# Altium schematic sheet MotoControl_V1.0.SchDoc
size A4
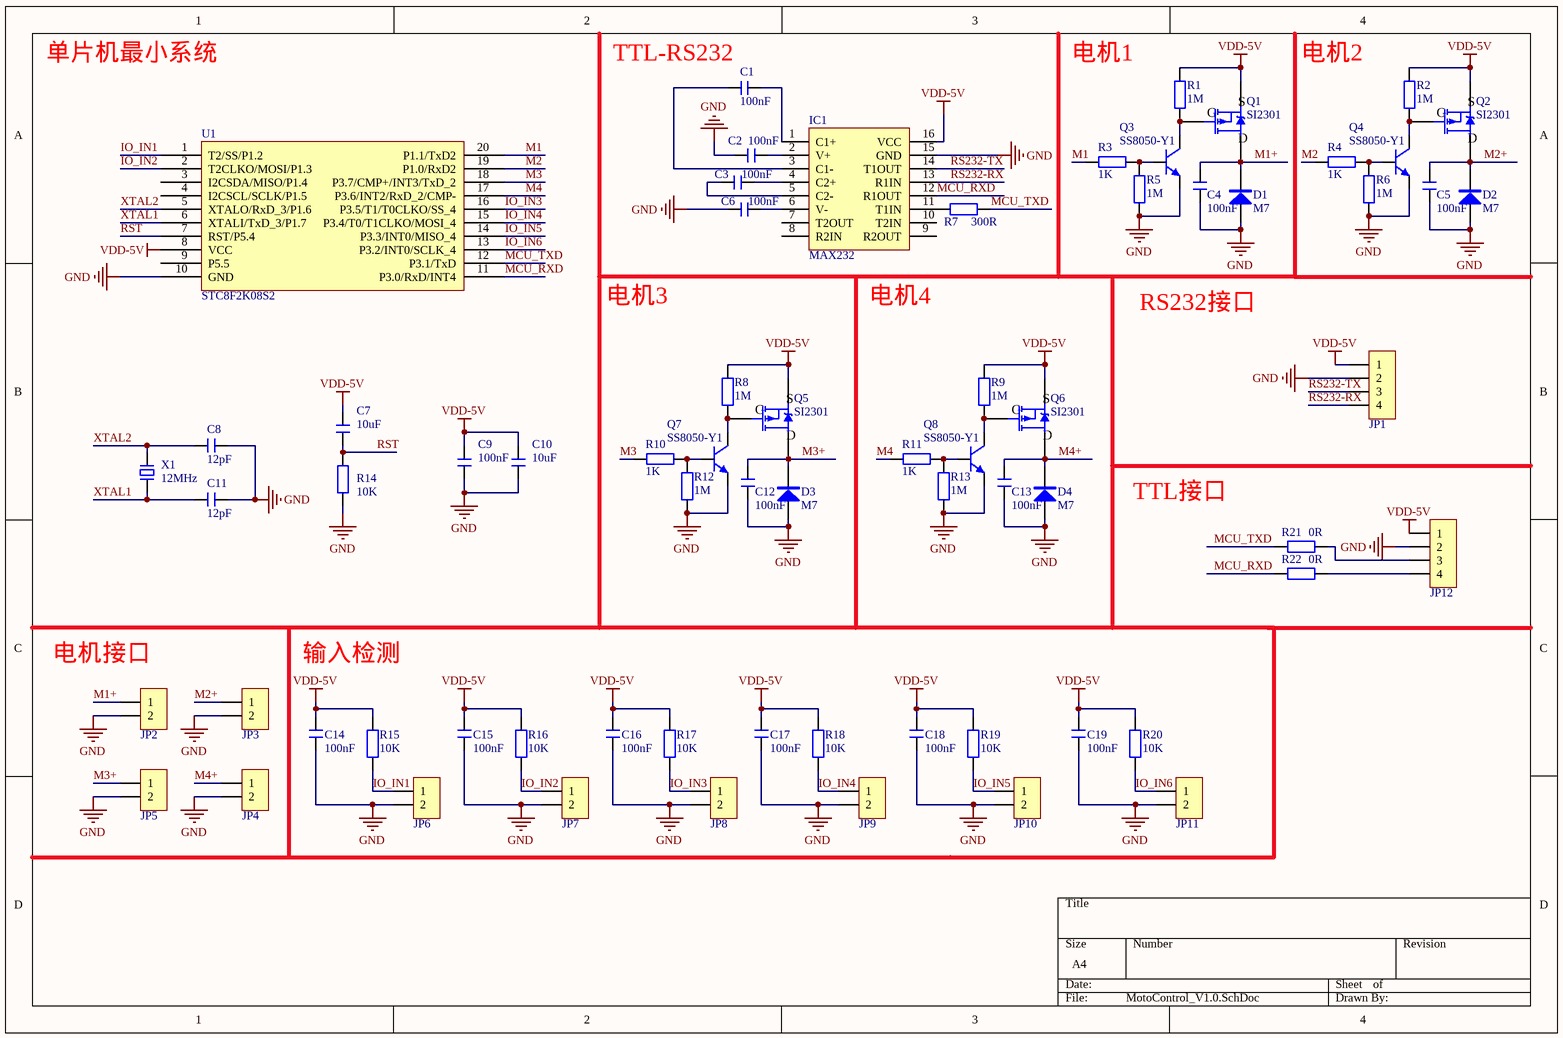
[diagram p0: MotoControl_V1.0.SchDoc]

## Parts
C1  100nF  [C_0603]
C2  100nF  [C_0603]
C3  100nF  [C_0603]
C4  100nF  [C_0603]
C5  100nF  [C_0603]
C6  100nF  [C_0603]
C7  10uF  [C_0603]
C8  12pF  [C_0603]
C9  100nF  [C_0603]
C10  10uF  [C_0603]
C11  12pF  [C_0603]
C12  100nF  [C_0603]
C13  100nF  [C_0603]
C14  100nF  [C_0603]
C15  100nF  [C_0603]
C16  100nF  [C_0603]
C17  100nF  [C_0603]
C18  100nF  [C_0603]
C19  100nF  [C_0603]
D1  M7  [SMA]
D2  M7  [SMA]
D3  M7  [SMA]
D4  M7  [SMA]
IC1  MAX232  [SOP16_N]
JP1  HDR-1X4  [XH2.54-4P]  (value not drawn)
JP2  HDR-1X2  [XH2.54-2P]  (value not drawn)
JP3  HDR-1X2  [XH2.54-2P]  (value not drawn)
JP4  HDR-1X2  [XH2.54-2P]  (value not drawn)
JP5  HDR-1X2  [XH2.54-2P]  (value not drawn)
JP6  HDR-1X2  [XH2.54-2P]  (value not drawn)
JP7  HDR-1X2  [XH2.54-2P]  (value not drawn)
JP8  HDR-1X2  [XH2.54-2P]  (value not drawn)
JP9  HDR-1X2  [XH2.54-2P]  (value not drawn)
JP10  HDR-1X2  [XH2.54-2P]  (value not drawn)
JP11  HDR-1X2  [XH2.54-2P]  (value not drawn)
JP12  HDR-1X4  [XH2.54-4P]  (value not drawn)
Q1  SI2301  [SOT23-3N]
Q2  SI2301  [SOT23-3N]
Q3  SS8050-Y1  [SOT23-3N]
Q4  SS8050-Y1  [SOT23-3N]
Q5  SI2301  [SOT23-3N]
Q6  SI2301  [SOT23-3N]
Q7  SS8050-Y1  [SOT23-3N]
Q8  SS8050-Y1  [SOT23-3N]
R1  1M  [R_0603]
R2  1M  [R_0603]
R3  1K  [R_0603]
R4  1K  [R_0603]
R5  1M  [R_0603]
R6  1M  [R_0603]
R7  300R  [R_0603]
R8  1M  [R_0603]
R9  1M  [R_0603]
R10  1K  [R_0603]
R11  1K  [R_0603]
R12  1M  [R_0603]
R13  1M  [R_0603]
R14  10K  [R_0603]
R15  10K  [R_0603]
R16  10K  [R_0603]
R17  10K  [R_0603]
R18  10K  [R_0603]
R19  10K  [R_0603]
R20  10K  [R_0603]
R21  0R  [R_0603]
R22  0R  [R_0603]
U1  STC8F2K08S2  [TSSOP20_N]
X1  12MHz  [SMD-3215_2P]

## Nets
GND: C2.1 C4.2 C5.2 C6.1 C8.2 C9.1 C10.1 C11.2 C12.2 C13.2 C14.1 C15.1 C16.1 C17.1 C18.1 C19.1 D1.1(A) D2.1(A) D3.1(A) D4.1(A) IC1.15(GND) JP1.2 JP2.2 JP3.2 JP4.2 JP5.2 JP6.2 JP7.2 JP8.2 JP9.2 JP10.2 JP11.2 JP12.2 Q3.2(E) Q4.2(E) Q7.2(E) Q8.2(E) R5.1 R6.1 R12.1 R13.1 R14.1 U1.10(GND)
VDD-5V: C7.2 C9.2 C10.2 C14.2 C15.2 C16.2 C17.2 C18.2 C19.2 IC1.16(VCC) JP1.1 JP12.1 Q1.2(S) Q2.2(S) Q5.2(S) Q6.2(S) R1.1 R2.1 R8.1 R9.1 R15.2 R16.2 R17.2 R18.2 R19.2 R20.2 U1.8(VCC)
IO_IN1: JP6.1 R15.1 U1.1(T2/SS/P1.2)
IO_IN2: JP7.1 R16.1 U1.2(T2CLKO/MOSI/P1.3)
IO_IN3: JP8.1 R17.1 U1.16(P3.5/T1/T0CLKO/SS_4)
IO_IN4: JP9.1 R18.1 U1.15(P3.4/T0/T1CLKO/MOSI_4)
IO_IN5: JP10.1 R19.1 U1.14(P3.3/INT0/MISO_4)
IO_IN6: JP11.1 R20.1 U1.13(P3.2/INT0/SCLK_4)
M1: R3.1 U1.20(P1.1/TxD2)
M1+: C4.1 D1.2(K) JP2.1 Q1.3(D)
M2: R4.1 U1.19(P1.0/RxD2)
M2+: C5.1 D2.2(K) JP3.1 Q2.3(D)
M3: R10.1 U1.18(P3.7/CMP+/INT3/TxD_2)
M3+: C12.1 D3.2(K) JP5.1 Q5.3(D)
M4: R11.1 U1.17(P3.6/INT2/RxD_2/CMP-)
M4+: C13.1 D4.2(K) JP4.1 Q6.3(D)
MCU_RXD: IC1.12(R1OUT) R22.1 U1.11(P3.0/RxD/INT4)
MCU_TXD: R7.2 R21.1 U1.12(P3.1/TxD)
RS232-RX: IC1.13(R1IN) JP1.4
RS232-TX: IC1.14(T1OUT) JP1.3
RST: C7.1 R14.2 U1.7(RST/P5.4)
XTAL1: C11.1 U1.6(XTALI/TxD_3/P1.7) X1.1
XTAL2: C8.1 U1.5(XTALO/RxD_3/P1.6) X1.2
NetC1_1: C1.1 IC1.3(C1-)
NetC1_2: C1.2 IC1.1(C1+)
NetC2_2: C2.2 IC1.2(V+)
NetC3_1: C3.1 IC1.5(C2-)
NetC3_2: C3.2 IC1.4(C2+)
NetC6_2: C6.2 IC1.6(V-)
NetIC1_11: IC1.11(T1IN) R7.1
NetJP12_3: JP12.3 R21.2
NetJP12_4: JP12.4 R22.2
NetQ1_1: Q1.1(G) Q3.3(C) R1.2
NetQ2_1: Q2.1(G) Q4.3(C) R2.2
NetQ3_1: Q3.1(B) R3.2 R5.2
NetQ4_1: Q4.1(B) R4.2 R6.2
NetQ5_1: Q5.1(G) Q7.3(C) R8.2
NetQ6_1: Q6.1(G) Q8.3(C) R9.2
NetQ7_1: Q7.1(B) R10.2 R12.2
NetQ8_1: Q8.1(B) R11.2 R13.2

Not connected (* = marked no-connect by the designer): IC1 7(T2OUT) 8(R2IN) 9(R2OUT) 10(T2IN); U1 3(I2CSDA/MISO/P1.4) 4(I2CSCL/SCLK/P1.5) 9(P5.5)

## Notes on the sheet
- 单片机最小系统
- (near C1) TTL-RS232
- 电机1
- 电机2
- 电机3
- (near IC1) 电机4
- RS232接口
- TTL接口
- (near JP2) 电机接口
- 输入检测

## Library data of the parts
C1-C3 C6-C11 C14-C19 = C: 无极性贴片电容; 版权: iSAIGU; 属性: ±10%_50V_X7R; BOM名称: 无极性贴片电容
C4 C5 C12 C13 = C: 无极性贴片电容; 版权: iSAIGU; Attribute: ±10%_50V_X7R; BOM名称: 无极性贴片电容
D1-D4 = M7: 整流二极管; 版权: iSAIGU; BOM名称: 整流二极管
IC1 = MAX232: 版权: iSAIGU; BOM名称: MAX232
JP1 JP12 = Header 4: 4P接插件; 版权: iSAIGU; BOM名称: 4P接插件
JP2-JP11 = Header 2: 2P接插件; 版权: iSAIGU; BOM名称: 2P接插件
Q1 Q2 Q5 Q6 = SI2301: P沟道场效应管; 版权: iSAIGU; BOM名称: P沟道场效应管
Q3 Q4 Q7 Q8 = 8050-Y1-SMD: 高频放大-NPN型; 版权: iSAIGU; 属性: 40V 1.5A 1W 100MHZ; BOM名称: 高频放大-NPN型
R1-R13 = R: ±1%; BOM名称: 贴片电阻; 版权: iSAIGU; Attribute: ±1%
R14-R22 = R: 贴片电阻; 版权: iSAIGU; 属性: ±1%; BOM名称: 贴片电阻
U1 = STC8F2K08S2: STC单片机; BOM名称: STC单片机
X1 = XTAL-2: 2脚晶振; 版权: iSAIGU; 属性: 7PF ± 20PPM; BOM名称: 2脚晶振